# Altium schematic sheet buttons.SchDoc
size A4
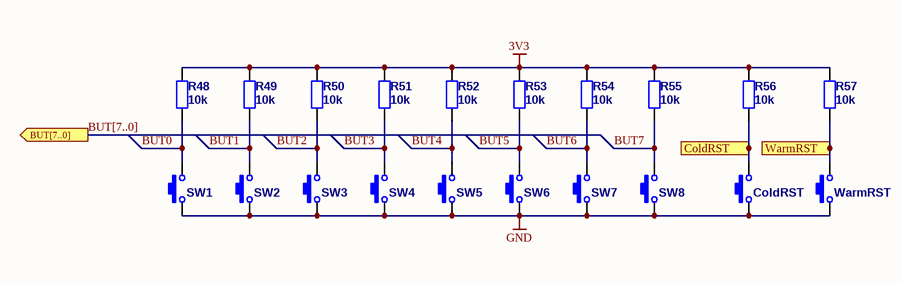
[diagram p0: buttons.SchDoc]

## Parts
ColdRST  TACTM-67N-F  [DTSM-6]  (value not drawn)
R48  10k  [R0603]
R49  10k  [R0603]
R50  10k  [R0603]
R51  10k  [R0603]
R52  10k  [R0603]
R53  10k  [R0603]
R54  10k  [R0603]
R55  10k  [R0603]
R56  10k  [R0603]
R57  10k  [R0603]
SW1  TACTM-67N-F  [DTSM-6]  (value not drawn)
SW2  TACTM-67N-F  [DTSM-6]  (value not drawn)
SW3  TACTM-67N-F  [DTSM-6]  (value not drawn)
SW4  TACTM-67N-F  [DTSM-6]  (value not drawn)
SW5  TACTM-67N-F  [DTSM-6]  (value not drawn)
SW6  TACTM-67N-F  [DTSM-6]  (value not drawn)
SW7  TACTM-67N-F  [DTSM-6]  (value not drawn)
SW8  TACTM-67N-F  [DTSM-6]  (value not drawn)
WarmRST  TACTM-67N-F  [DTSM-6]  (value not drawn)

## Ports
BUT[7..0] (out), ColdRST (out), WarmRST (out)

## Nets
3V3: R48.2 R49.2 R50.2 R51.2 R52.2 R53.2 R54.2 R55.2 R56.2 R57.2
GND: ColdRST.1 SW1.1 SW2.1 SW3.1 SW4.1 SW5.1 SW6.1 SW7.1 SW8.1 WarmRST.1
BUT0: R48.1 SW1.2
BUT1: R49.1 SW2.2
BUT2: R50.1 SW3.2
BUT3: R51.1 SW4.2
BUT4: R52.1 SW5.2
BUT5: R53.1 SW6.2
BUT6: R54.1 SW7.2
BUT7: R55.1 SW8.2
ColdRST: ColdRST.2 R56.1 ; port ColdRST
WarmRST: R57.1 WarmRST.2 ; port WarmRST

## Buses and harness runs
bus BUT[7..0] = port BUT[7..0]

## Library data of the parts
ColdRST SW1-SW8 WarmRST = TACTM-67N-F: 6x6mm SMD Tactile SPST-NO Switch
R48-R57 = Res: Resistor; Published: 19-Feb-2006; ComponentLink1Description: datasheet; ComponentLink2Description: supplier; Value: 10k